# EAGLE design xenium-progrogrammer-rpi (EAGLE 9.6.1)
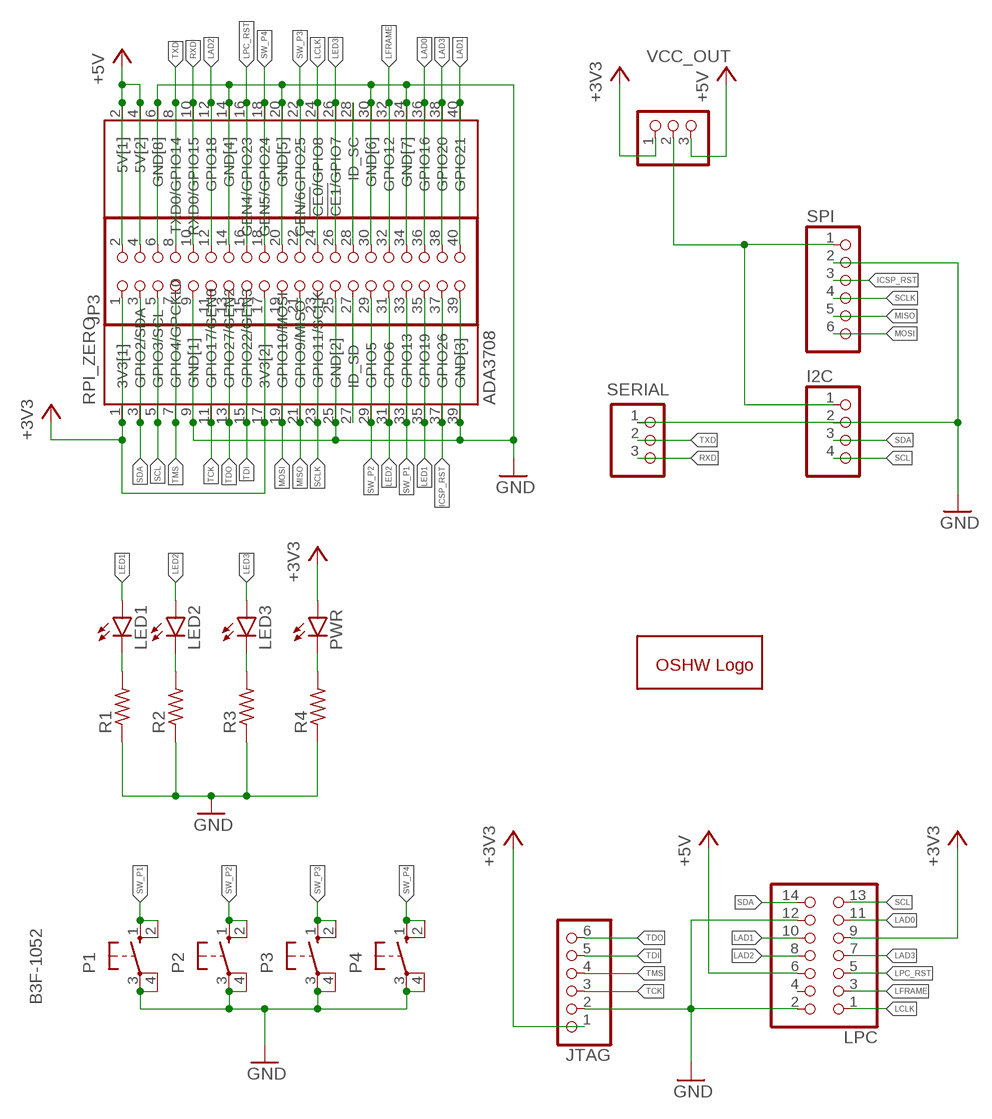
[diagram p0: schematic, sheet 1]

## Parts
GOLD_ORB_SM1  OSHWLOGOLOGO8MM  [OSHW_8MM]
I2C  PINHD-1X4  [1X04]
JP3  PINHD-2X20  [2X20]
JTAG  PINHD-1X6  [1X06]
LED1  LED5MM  [LED5MM]
LED2  LED5MM  [LED5MM]
LED3  LED5MM  [LED5MM]
LPC  PINHD-2X7  [2X07]
P1  B3F-1052  [B3F-10XX]
P2  B3F-1052  [B3F-10XX]
P3  B3F-1052  [B3F-10XX]
P4  B3F-1052  [B3F-10XX]
PWR  LED5MM  [LED5MM]
R1  R-US_0207/10  [0207/10]
R2  R-US_0207/10  [0207/10]
R3  R-US_0207/10  [0207/10]
R4  R-US_0207/10  [0207/10]
RPI_ZERO  ADA3708  [ADA3708_RPI-ZERO]
SERIAL  PINHD-1X3  [1X03]
SPI  PINHD-1X6  [1X06]
VCC_OUT  PINHD-1X3  [1X03]

## Nets
+3V3: JP3.1 JP3.17 JTAG.1 LPC.9 PWR.A RPI_ZERO.1(3V3[1]) RPI_ZERO.17(3V3[2]) VCC_OUT.1
+5V: JP3.2 JP3.4 LPC.6 RPI_ZERO.2(5V[1]) RPI_ZERO.4(5V[2]) VCC_OUT.3
GND: I2C.2 JP3.6 JP3.9 JP3.14 JP3.20 JP3.25 JP3.30 JP3.34 JP3.39 JTAG.2 LPC.2 LPC.12 P1.3(P) P1.4(P1) P2.3(P) P2.4(P1) P3.3(P) P3.4(P1) P4.3(P) P4.4(P1) R1.1 R2.1 R3.1 R4.1 RPI_ZERO.6(GND[8]) RPI_ZERO.9(GND[1]) RPI_ZERO.14(GND[4]) RPI_ZERO.20(GND[5]) RPI_ZERO.25(GND[2]) RPI_ZERO.30(GND[6]) RPI_ZERO.34(GND[7]) RPI_ZERO.39(GND[3]) SERIAL.1 SPI.2
ICSP_RST: JP3.37 RPI_ZERO.37(GPIO26) SPI.3
LAD0: JP3.36 LPC.11 RPI_ZERO.36(GPIO16)
LAD1: JP3.40 LPC.10 RPI_ZERO.40(GPIO21)
LAD2: JP3.12 LPC.8 RPI_ZERO.12(GPIO18)
LAD3: JP3.38 LPC.7 RPI_ZERO.38(GPIO20)
LCLK: JP3.24 LPC.1 RPI_ZERO.24(!CE0!/GPIO8)
LED1: JP3.35 LED1.A RPI_ZERO.35(GPIO19)
LED2: JP3.31 LED2.A RPI_ZERO.31(GPIO6)
LED3: JP3.26 LED3.A RPI_ZERO.26(!CE1/!GPIO7)
LFRAME: JP3.32 LPC.3 RPI_ZERO.32(GPIO12)
LPC_RST: JP3.16 LPC.5 RPI_ZERO.16(GEN4/GPIO23)
MISO: JP3.21 RPI_ZERO.21(GPIO9/MISO) SPI.5
MOSI: JP3.19 RPI_ZERO.19(GPIO10/MOSI) SPI.6
N$1: LED1.K(C) R1.2
N$2: JP3.27 RPI_ZERO.27(ID_SD)
N$3: LED2.K(C) R2.2
N$4: LED3.K(C) R3.2
N$5: PWR.K(C) R4.2
N$36: JP3.28 RPI_ZERO.28(ID_SC)
RXD: JP3.10 RPI_ZERO.10(RXD0/GPIO15) SERIAL.3
SCL: I2C.4 JP3.5 LPC.13 RPI_ZERO.5(GPIO3/SCL)
SCLK: JP3.23 RPI_ZERO.23(GPIO11/SCLK) SPI.4
SDA: I2C.3 JP3.3 LPC.14 RPI_ZERO.3(GPIO2/SDA)
SW_P1: JP3.33 P1.1(S) P1.2(S1) RPI_ZERO.33(GPIO13)
SW_P2: JP3.29 P2.1(S) P2.2(S1) RPI_ZERO.29(GPIO5)
SW_P3: JP3.22 P3.1(S) P3.2(S1) RPI_ZERO.22(GEN/6GPIO25)
SW_P4: JP3.18 P4.1(S) P4.2(S1) RPI_ZERO.18(GEN5/GPIO24)
TCK: JP3.11 JTAG.3 RPI_ZERO.11(GPIO17/GEN0)
TDI: JP3.15 JTAG.5 RPI_ZERO.15(GPIO22/GEN3)
TDO: JP3.13 JTAG.6 RPI_ZERO.13(GPIO27/GEN2)
TMS: JP3.7 JTAG.4 RPI_ZERO.7(GPIO4/GPCKL0)
TXD: JP3.8 RPI_ZERO.8(TXD0/GPIO14) SERIAL.2
VCC_OUT: I2C.1 SPI.1 VCC_OUT.2
Unconnected: LPC.4

## Library data of the parts
GOLD_ORB_SM1 = oshw:OSHWLOGO: The OSHW logo for PCB layout
I2C = pinhead:PINHD-1X4: PIN HEADER
JP3 = pinhead:PINHD-2X20: PIN HEADER
JTAG SPI = pinhead:PINHD-1X6: PIN HEADER
LED1-LED3 PWR = led:LED: LED OSRAM: - CHIPLED LG R971, LG N971, LY N971, LG Q971, LY Q971, LO R971, LY R971 LH N974, LH R974 LS Q976, LO Q976, LY Q976 LO Q996 - Hyper CHIPLED LW Q18S LB Q993, LB Q99A, LB R99A - SideLED LS A670, LO A670, LY A670, LG A670, LP A670 LB A673, LV A673, LT A673, LW A673 LH A674 LY A675 LS A676, LA A676, LO A676, LY A676, LW A676 LS A679, LY A679, LG A679 - Hyper Micro SIDELED® LS Y876, LA Y876, LO Y876, LY Y876 LT Y87S - SmartLED LW L88C, LW L88S LB L89C, LB L89S, LG L890 LS L89K, LO L89K, LY L89K LS L896, LA L896, LO L896, LY L896 - TOPLED LS T670, LO T670, LY T670, LG T670, LP T670 LSG T670, LSP T670, LSY T670, LOP T670, LYG T670 LG T671, LOG T671, LSG T671 LB T673, LV T673, LT T673, LW T673 LH T674 LS T676, LA T676, LO T676, LY T676, LB T676, LH T676, LSB T676, LW T676 LB T67C, LV T67C, LT T67C, LS T67K, LO T67K, LY T67K, LW E67C LS E67B, LA E67B, LO E67B, LY E67B, LB E67C, LV E67C, LT E67C LW T67C LS T679, LY T679, LG T679 LS T770, LO T770, LY T770, LG T770, LP T770 LB T773, LV T773, LT T773, LW T773 LH T774 LS E675, LA E675, LY E675, LS T675 LS T776, LA T776, LO T776, LY T776, LB T776 LHGB T686 LT T68C, LB T68C - Hyper Mini TOPLED® LB M676 - Mini TOPLED Santana® LG M470 LS M47K, LO M47K, LY M47K Source: http://www.osram.convergy.de LUXEON: - LUMILED® LXK2-PW12-R00, LXK2-PW12-S00, LXK2-PW14-U00, LXK2-PW14-V00 LXK2-PM12-R00, LXK2-PM12-S00, LXK2-PM14-U00 LXK2-PE12-Q00, LXK2-PE12-R00, LXK2-PE12-S00, LXK2-PE14-T00, LXK2-PE14-U00 LXK2-PB12-K00, LXK2-PB12-L00, LXK2-PB12-M00, LXK2-PB14-N00, LXK2-PB14-P00, LXK2-PB14-Q00 LXK2-PR12-L00, LXK2-PR12-M00, LXK2-PR14-Q00, LXK2-PR14-R00 LXK2-PD12-Q00, LXK2-PD12-R00, LXK2-PD12-S00 LXK2-PH12-R00, LXK2-PH12-S00 LXK2-PL12-P00, LXK2-PL12-Q00, LXK2-PL12-R00 Source: www.luxeon.com KINGBRIGHT: KA-3528ASYC Source: www.kingbright.com
LPC = pinhead:PINHD-2X7: PIN HEADER
P1-P4 = B3F-1052:B3F-1052: OMRON SWITCH 1.1mm holes; AVAILABILITY: Unavailable; DESCRIPTION: Tactile Switch; MF: Omron; MP: B3F-1052; PACKAGE: None; PRICE: None
R1-R4 = rcl:R-US_: RESISTOR, American symbol; SPICEPREFIX: R
RPI_ZERO = ADA3708:ADA3708: Raspberry Pi Zero WH (Zero W with Headers); AVAILABILITY: Unavailable; DESCRIPTION: Raspberry Pi Zero WH (Zero W with Headers); MF: Raspberry Pi; MP: ADA3708; PACKAGE: None; PRICE: None
SERIAL VCC_OUT = pinhead:PINHD-1X3: PIN HEADER

## Board
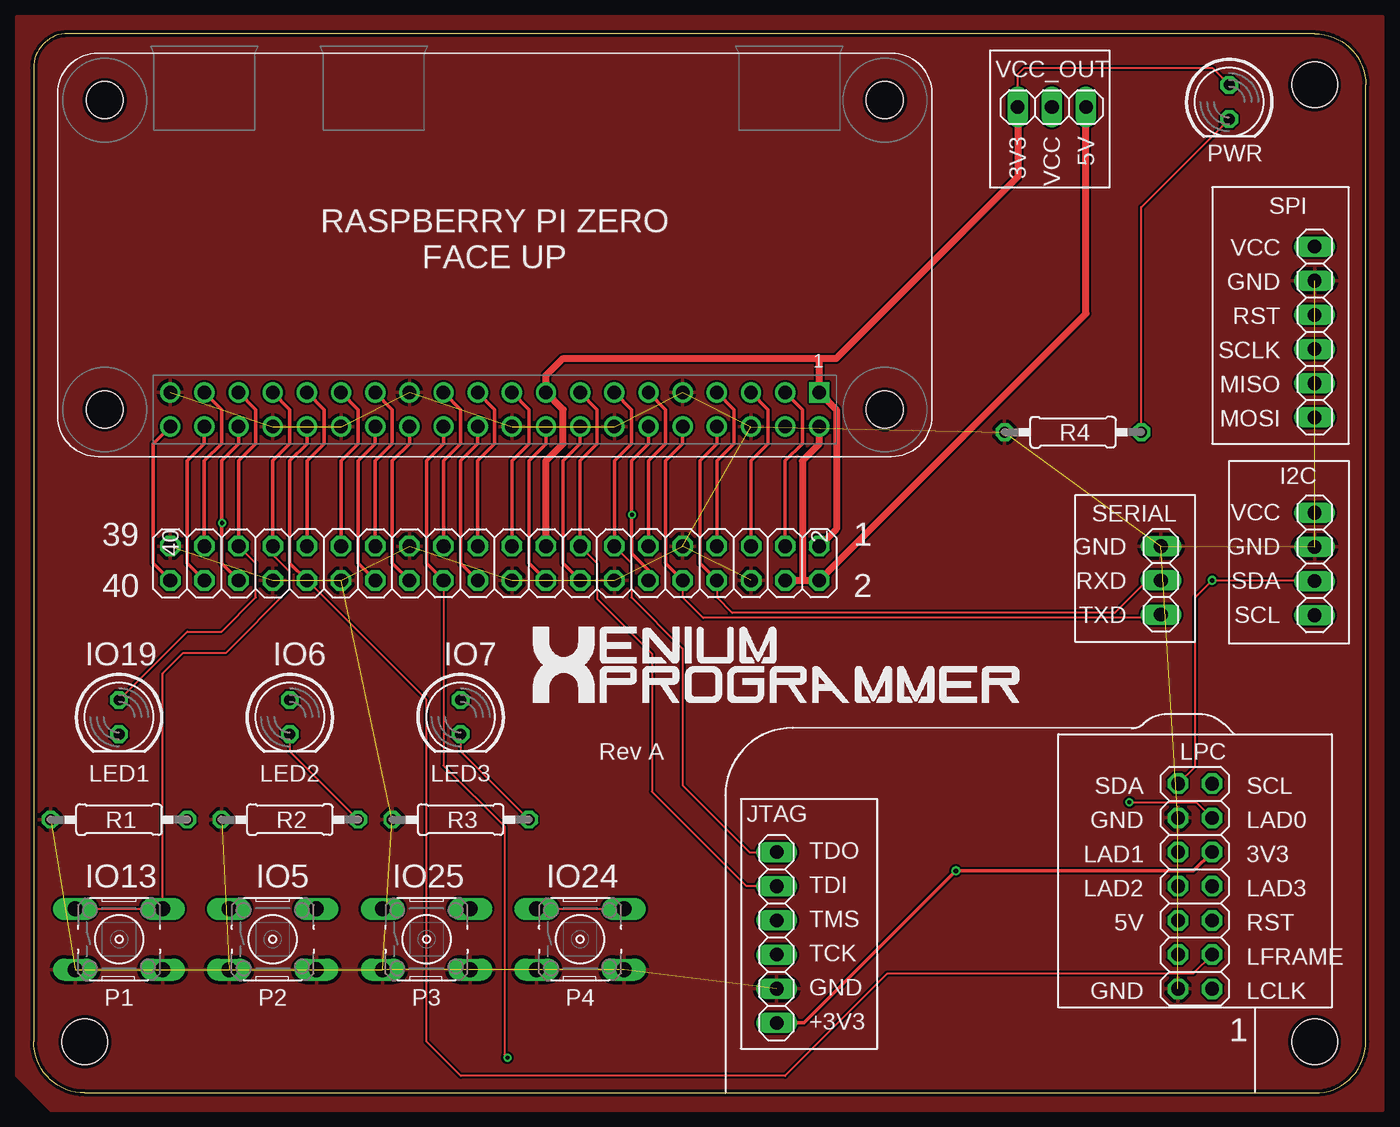
[diagram p1: board, top side]
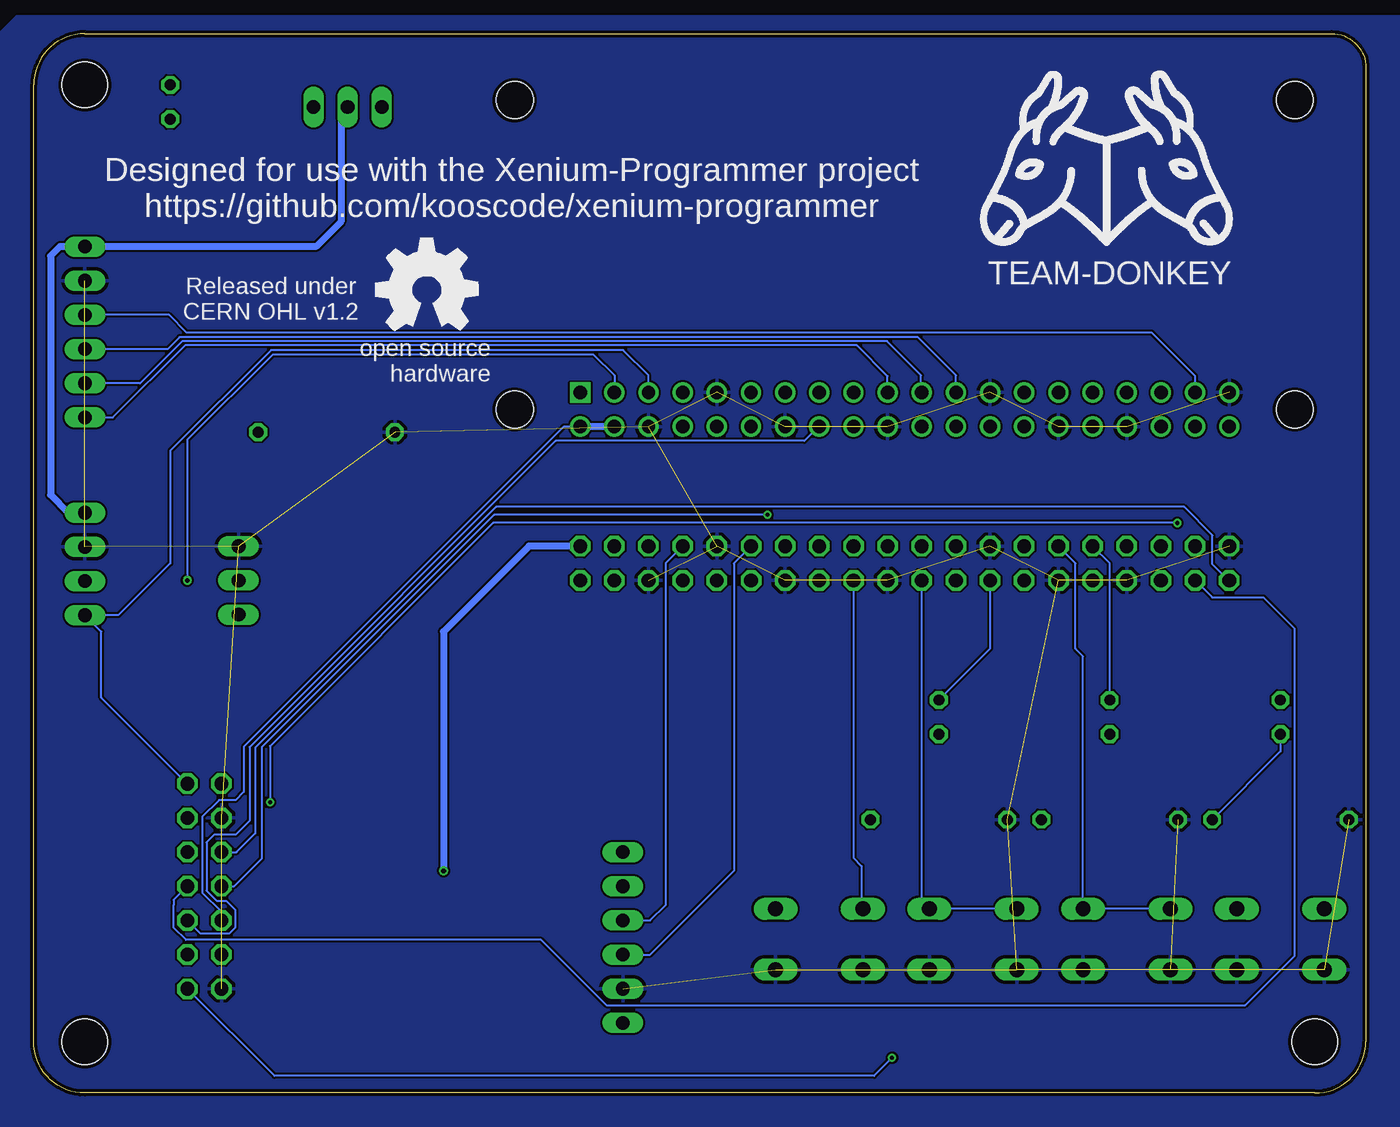
[diagram p2: board, bottom side, seen from below]

Size 99.06 x 78.74 mm. Coordinates in mm from the lower left corner, seen from the top.
Outline: 3.81,0 95.25,0 arc90 99.06,3.81 99.06,74.93 arc90 95.25,78.74 2.54,78.74 arc90 0,76.2 0,3.81 arc90 3.81,0
Copper layers (1*16): Top 0.035mm / dielectric 0.15mm / Bottom 0.035mm
Design rules "default": minimum track width 6mil, minimum drill 12mil, track to track 6mil, track to pad 6mil, pad to pad 6mil, via to via 6mil, smd to smd 0mil, copper to edge 10mil, drill to drill 10mil, minimum pad ring 10mil, minimum via ring 6mil, stop-mask expansion 2mil, vias tented up to drill 100mil, thermal gap 10mil
Holes 3.4 mm at 3.81,3.81 95.25,3.81 95.25,74.93

### Footprints (pad centres in the part's own frame; a part is rotated, then mirrored left to right if it is on the bottom)
1X04 = drill 1.016 long: 1 -3.81,0; 2 -1.27,0; 3 1.27,0; 4 3.81,0
2X20 = drill 1.016 octagon: 1 -24.13,-1.27; 2 -24.13,1.27; 3 -21.59,-1.27; 4 -21.59,1.27; 5 -19.05,-1.27; 6 -19.05,1.27; 7 -16.51,-1.27; 8 -16.51,1.27; 9 -13.97,-1.27; 10 -13.97,1.27; 11 -11.43,-1.27; 12 -11.43,1.27; 13 -8.89,-1.27; 14 -8.89,1.27; 15 -6.35,-1.27; 16 -6.35,1.27; 17 -3.81,-1.27; 18 -3.81,1.27; 19 -1.27,-1.27; 20 -1.27,1.27; 21 1.27,-1.27; 22 1.27,1.27; 23 3.81,-1.27; 24 3.81,1.27; 25 6.35,-1.27; 26 6.35,1.27; 27 8.89,-1.27; 28 8.89,1.27; 29 11.43,-1.27; 30 11.43,1.27; 31 13.97,-1.27; 32 13.97,1.27; 33 16.51,-1.27; 34 16.51,1.27; 35 19.05,-1.27; 36 19.05,1.27; 37 21.59,-1.27; 38 21.59,1.27; 39 24.13,-1.27; 40 24.13,1.27
1X06 = drill 1.016 long: 1 -6.35,0; 2 -3.81,0; 3 -1.27,0; 4 1.27,0; 5 3.81,0; 6 6.35,0
LED5MM = drill 0.813 octagon: A -1.27,0; K 1.27,0
2X07 = drill 1.016 octagon: 1 -7.62,-1.27; 2 -7.62,1.27; 3 -5.08,-1.27; 4 -5.08,1.27; 5 -2.54,-1.27; 6 -2.54,1.27; 7 0,-1.27; 8 0,1.27; 9 2.54,-1.27; 10 2.54,1.27; 11 5.08,-1.27; 12 5.08,1.27; 13 7.62,-1.27; 14 7.62,1.27
B3F-10XX = drill 1.1 long: 1 -3.251,2.261; 2 3.251,2.261; 3 -3.251,-2.261; 4 3.251,-2.261
0207/10 = drill 0.813 octagon: 1 -5.08,0; 2 5.08,0
ADA3708_RPI-ZERO = drill 1 square: 1 -24.13,-1.27 | drill 1: 2 -24.13,1.27; 3 -21.59,-1.27; 4 -21.59,1.27; 5 -19.05,-1.27; 6 -19.05,1.27; 7 -16.51,-1.27; 8 -16.51,1.27; 9 -13.97,-1.27; 10 -13.97,1.27; 11 -11.43,-1.27; 12 -11.43,1.27; 13 -8.89,-1.27; 14 -8.89,1.27; 15 -6.35,-1.27; 16 -6.35,1.27; 17 -3.81,-1.27; 18 -3.81,1.27; 19 -1.27,-1.27; 20 -1.27,1.27; 21 1.27,-1.27; 22 1.27,1.27; 23 3.81,-1.27; 24 3.81,1.27; 25 6.35,-1.27; 26 6.35,1.27; 27 8.89,-1.27; 28 8.89,1.27; 29 11.43,-1.27; 30 11.43,1.27; 31 13.97,-1.27; 32 13.97,1.27; 33 16.51,-1.27; 34 16.51,1.27; 35 19.05,-1.27; 36 19.05,1.27; 37 21.59,-1.27; 38 21.59,1.27; 39 24.13,-1.27; 40 24.13,1.27 | hole 2.75: -29,-23; -29,0; 29,-23; 29,0
1X03 = drill 1.016 long: 1 -2.54,0; 2 0,0; 3 2.54,0

### Placement (x,y rotation side)
GOLD_ORB_SM1  69.85,59.69 0 bottom
I2C  95.25,39.32 270 top
JP3  34.29,39.37 180 top
JTAG  55.24,11.56 90 top
LED1  6.35,27.94 270 top
LED2  19.05,27.94 270 top
LED3  31.75,27.94 270 top
LPC  86.36,15.37 90 top
P1  6.35,11.43 0 top
P2  17.78,11.43 0 top
P3  29.21,11.43 0 top
P4  40.64,11.43 0 top
PWR  88.9,73.66 270 top
R1  6.35,20.32 0 top
R2  19.05,20.32 0 top
R3  31.75,20.32 0 top
R4  77.28,49.12 0 top
RPI_ZERO  34.29,50.8 180 top
SERIAL  83.82,38.1 270 top
SPI  95.25,56.56 270 top
VCC_OUT  75.71,73.28 0 top

### Tracks (layer width: path | path; a pad name or v marks a point on that pad's centre or on a via)
+3V3  (via drill 0.35)
  Top 0.152: VCC_OUT.1 73.17,75.71 73.66,76.2 87.63,76.2 PWR.A
  Top 0.254: JTAG.1 57.28,5.21 v68.58,16.51 86.23,16.51 LPC.9
  Top 0.508: JP3.1 59.69,41.91 59.69,50.8 RPI_ZERO.1 58.42,54.61 | JP3.17 38.1,46.99 39.37,48.26 39.37,50.8 RPI_ZERO.17 38.1,53.34 39.37,54.61 58.42,54.61 | VCC_OUT.1 73.17,68.09 59.69,54.61 58.42,54.61
  Bottom 0.508: JP3.1 62.23,40.64 68.58,34.29 v68.58,16.51
+5V
  Top 0.508: RPI_ZERO.2 58.42,48.26 57.15,46.99 57.15,38.1 | JP3.4 57.15,38.1 | 57.15,38.1 JP3.2 78.25,57.93 VCC_OUT.3
  Bottom 0.152: RPI_ZERO.2 59.64,49.53 83.44,25.73 83.44,22.38 84.05,21.77 85.27,21.77 86.51,20.52 86.51,14.88 85.09,13.46 LPC.6
  Bottom 0.508: RPI_ZERO.4 RPI_ZERO.2
GND  (33 unrouted)
  pour Top: -1.27,80.01 100.33,80.01 100.33,-1.27 1.27,-1.27 -1.27,1.27
  pour Bottom: -2.54,80.01 100.33,80.01 101.6,78.74 101.6,-2.54 -5.08,-2.54 -5.08,77.47
ICSP_RST
  Top 0.254: JP3.37 12.7,46.99 13.97,48.26 13.97,50.8 RPI_ZERO.37
  Bottom 0.152: SPI.3 88.98,57.83 87.67,56.52 15.93,56.52 12.7,53.29 RPI_ZERO.37
LAD0  (via drill 0.3)
  Top 0.152: v81.48,21.61 81.51,21.59 86.36,21.59 86.49,21.59 LPC.11 | v14.02,42.37 13.97,42.37
  Top 0.254: JP3.36 13.97,39.37 13.97,42.37 13.97,46.99 15.24,48.26 RPI_ZERO.36
  Bottom 0.152: v81.48,21.61 81.48,25.78 64.9,42.37 v14.02,42.37
LAD1
  Top 0.254: JP3.40 8.89,39.37 8.89,48.26 RPI_ZERO.40
  Bottom 0.152: JP3.40 10.21,38.1 11.4,39.29 11.4,41.45 13.51,43.56 64.67,43.56 82.58,25.65 82.58,19.3 83.96,17.92 83.97,17.91 LPC.10
LAD2  (via drill 0.3)
  Top 0.152: v44.5,42.98 44.45,42.98
  Top 0.254: JP3.12 45.72,38.86 44.45,40.13 44.45,42.98 44.45,46.99 45.72,48.26 RPI_ZERO.12
  Bottom 0.152: v44.5,42.98 64.82,42.98 82.09,25.7 82.09,17.42 84.05,15.47 84.15,15.37 LPC.8
LAD3
  Top 0.254: JP3.38 11.43,39.37 11.43,46.99 12.7,48.26 RPI_ZERO.38
  Bottom 0.152: JP3.38 11.43,36.83 7.62,36.83 5.33,34.54 5.33,10.16 8.97,6.53 56.46,6.53 61.32,11.38 87.73,11.38 88.65,12.29 88.65,13.97 88.65,14.35 LPC.7
LCLK  (via drill 0.3)
  Top 0.152: v35.23,2.62 35,2.85 35,19.81 30.48,24.33 JP3.24
  Top 0.254: JP3.24 29.21,39.37 29.21,46.99 30.48,48.26 RPI_ZERO.24
  Bottom 0.152: v35.23,2.62 36.58,1.27 81.15,1.27 LPC.1
LED1
  Top 0.152: LED1.A 11.43,34.29 13.97,34.29 16.51,36.83 16.51,39.37 JP3.35
  Top 0.254: JP3.35 15.24,46.99 16.51,48.26 16.51,50.8 RPI_ZERO.35
LED2
  Top 0.254: JP3.31 20.32,46.99 21.59,48.26 21.59,50.8 RPI_ZERO.31
  Bottom 0.152: JP3.31 19.05,39.37 LED2.A
LED3
  Top 0.254: JP3.26 26.67,39.37 26.67,46.99 27.94,48.26 RPI_ZERO.26
  Bottom 0.152: JP3.26 27.94,33.02 LED3.A
LFRAME
  Top 0.152: JP3.32 29.21,29.21 29.21,3.81 31.75,1.27 55.88,1.27 63.5,8.89 86.23,8.89 LPC.3
  Top 0.254: JP3.32 19.05,39.37 19.05,46.99 20.32,48.26 RPI_ZERO.32
LPC_RST
  Top 0.254: JP3.16 39.37,39.37 39.37,46.99 40.64,48.26 RPI_ZERO.16
  Bottom 0.152: RPI_ZERO.16 40.69,49.53 41.76,48.46 60.25,48.46 83.01,25.7 83.01,20.22 84.02,19.2 85.62,19.2 86.21,18.62 86.21,15.04 85.45,14.28 84.73,14.28 84.07,13.61 84.07,12.29 84.53,11.84 86.64,11.84 LPC.5
MISO
  Top 0.254: JP3.21 33.02,46.99 34.29,48.26 34.29,50.8 RPI_ZERO.21
  Bottom 0.152: RPI_ZERO.21 33.07,52.12 33.07,53.34 35.61,55.88 88.01,55.88 91.14,52.75 SPI.5
MOSI
  Top 0.254: JP3.19 35.56,46.99 36.83,48.26 36.83,50.8 RPI_ZERO.19
  Bottom 0.152: SPI.6 93.17,50.21 87.81,55.58 37.85,55.58 35.56,53.29 RPI_ZERO.19
N$1
  Bottom 0.152: LED1.K 6.35,25.4 R1.2
N$2
  Top 0.254: JP3.27 25.4,46.99 26.67,48.26 26.67,50.8 RPI_ZERO.27
N$3
  Top 0.152: LED2.K 19.05,25.4 R2.2
N$4
  Top 0.152: LED3.K 31.75,25.4 R3.2
N$5
  Top 0.152: R4.2 82.36,65.85 PWR.K
N$36
  Top 0.254: JP3.28 24.13,39.37 24.13,46.99 25.4,48.26 RPI_ZERO.28
RXD
  Top 0.152: JP3.10 48.26,36.83 49.78,35.31 83.69,35.31 83.82,35.43 SERIAL.3
  Top 0.254: JP3.10 46.99,39.37 46.99,46.99 48.26,48.26 RPI_ZERO.10
SCL
  Top 0.254: JP3.5 53.34,46.99 54.61,48.26 54.61,50.8 RPI_ZERO.5
  Bottom 0.152: RPI_ZERO.5 53.34,53.34 55.22,55.22 81.41,55.22 88.9,47.73 88.9,39.37 92.76,35.51 I2C.4 94.03,34.29 94.03,29.39 LPC.13
SCLK
  Top 0.254: JP3.23 30.48,46.99 31.75,48.26 31.75,50.8 RPI_ZERO.23
  Bottom 0.152: RPI_ZERO.23 30.48,53.34 33.33,56.19 88.21,56.19 89.11,55.29 SPI.4
SDA  (via drill 0.35)
  Top 0.152: I2C.3 95.2,38.1 v87.63,38.1 86.36,36.83 86.36,24.26 LPC.14
  Top 0.254: JP3.3 55.88,46.99 57.15,48.26 57.15,50.8 RPI_ZERO.3
  Bottom 0.152: RPI_ZERO.3 55.88,53.34 57.43,54.89 81.28,54.89 87.63,48.54 v87.63,38.1
SW_P1
  Top 0.152: P1.1 P1.2 9.6,31.19 11.12,32.72 14.3,32.72 19.05,37.47 19.05,38.73 17.78,40.01 JP3.33
  Top 0.254: RPI_ZERO.33 19.05,50.8 19.05,48.26 17.78,46.99 JP3.33
SW_P2
  Top 0.254: JP3.29 22.86,46.99 24.13,48.26 24.13,50.8 RPI_ZERO.29
  Bottom 0.152: P2.1 P2.2 21.03,32.46 21.59,33.02 21.59,39.37 JP3.29
SW_P3
  Top 0.254: JP3.22 31.75,39.37 31.75,46.99 33.02,48.26 RPI_ZERO.22
  Bottom 0.152: P3.1 P3.2 33.02,14.25 JP3.22
SW_P4
  Top 0.152: P4.1 P4.2
  Top 0.254: JP3.18 36.83,39.37 36.83,46.99 38.1,48.26 RPI_ZERO.18
  Bottom 0.152: JP3.18 38.1,17.48 37.49,16.87 37.49,13.82 P4.1
TCK
  Top 0.254: JP3.11 45.72,46.99 46.99,48.26 46.99,50.8 RPI_ZERO.11
  Bottom 0.152: JP3.11 46.99,39.37 46.99,16.51 53.21,10.29 JTAG.3
TDI
  Top 0.152: JTAG.5 53.01,15.37 45.97,22.4 45.97,32.66 41.91,36.73 41.91,39.37 JP3.15
  Top 0.254: JP3.15 40.64,46.99 41.91,48.26 41.91,50.8 RPI_ZERO.15
TDO
  Top 0.152: JP3.13 44.45,39.37 44.45,36.83 48.26,33.02 48.26,22.86 53.21,17.91 JTAG.6
  Top 0.254: JP3.13 43.18,46.99 44.45,48.26 44.45,50.8 RPI_ZERO.13
TMS
  Top 0.254: JP3.7 50.8,46.99 52.07,48.26 52.07,50.8 RPI_ZERO.7
  Bottom 0.152: JP3.7 52.07,39.37 52.07,13.97 53.21,12.83 JTAG.4
TXD
  Top 0.152: JP3.8 50.8,36.83 51.94,35.69 80.39,35.69 82.8,38.1 SERIAL.2
  Top 0.254: JP3.8 49.53,39.37 49.53,46.99 50.8,48.26 RPI_ZERO.8
VCC_OUT
  Bottom 0.508: I2C.1 96.47,43.13 97.79,44.45 97.79,62.23 97.11,62.91 SPI.1 78.06,62.91 76.2,64.77 76.2,72.79 VCC_OUT.2

### Text on the board
tPlace: 3V3 | VCC | 5V | RASPBERRY PI ZERO / FACE UP | VCC | GND | RST | SCLK | MISO | MOSI | VCC | 40 | 2 | 39 | 1 | GND | GND | RXD | SDA | 40 | 2 | TXD | SCL | IO19 | IO6 | IO7 | Rev A | SDA | SCL | GND | LAD0 | TDO | LAD1 | 3V3 | IO13 | IO5 | IO25 | IO24 | TDI | LAD2 | LAD3 | TMS | 5V | RST | TCK | LFRAME | GND | GND | LCLK | +3V3 | 1
bPlace: Designed for use with the Xenium-Programmer project / https://github.com/kooscode/xenium-programmer | TEAM-DONKEY | Released under / CERN OHL v1.2